# EAGLE schematic Power Supply REV0 (EAGLE 8.4.1)
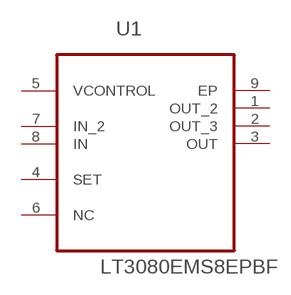
[diagram p0: schematic, sheet 1]

## Parts
U1  LT3080EMS8EPBF  [SOP65P490X110-9N]
Unconnected: U1.1(OUT_2) U1.2(OUT_3) U1.3(OUT) U1.4(SET) U1.6(NC) U1.7(IN_2) U1.8(IN) U1.9(EP)

## Power pins joined to a net without a drawn wire
VCONTROL: U1.5(VCONTROL)

## Library data of the parts
U1 = LT3080:LT3080EMS8EPBF: Adjustable1.1A Single Resistor Low Dropout Regulator; MPN: LT3080EMS8E#PBF; OC_FARNELL: 1663552; OC_NEWARK: 75M4716; PACKAGE: MSOP-8; SUPPLIER: Linear Technology